# EAGLE design fl3xwatch (EAGLE 9.6.2)
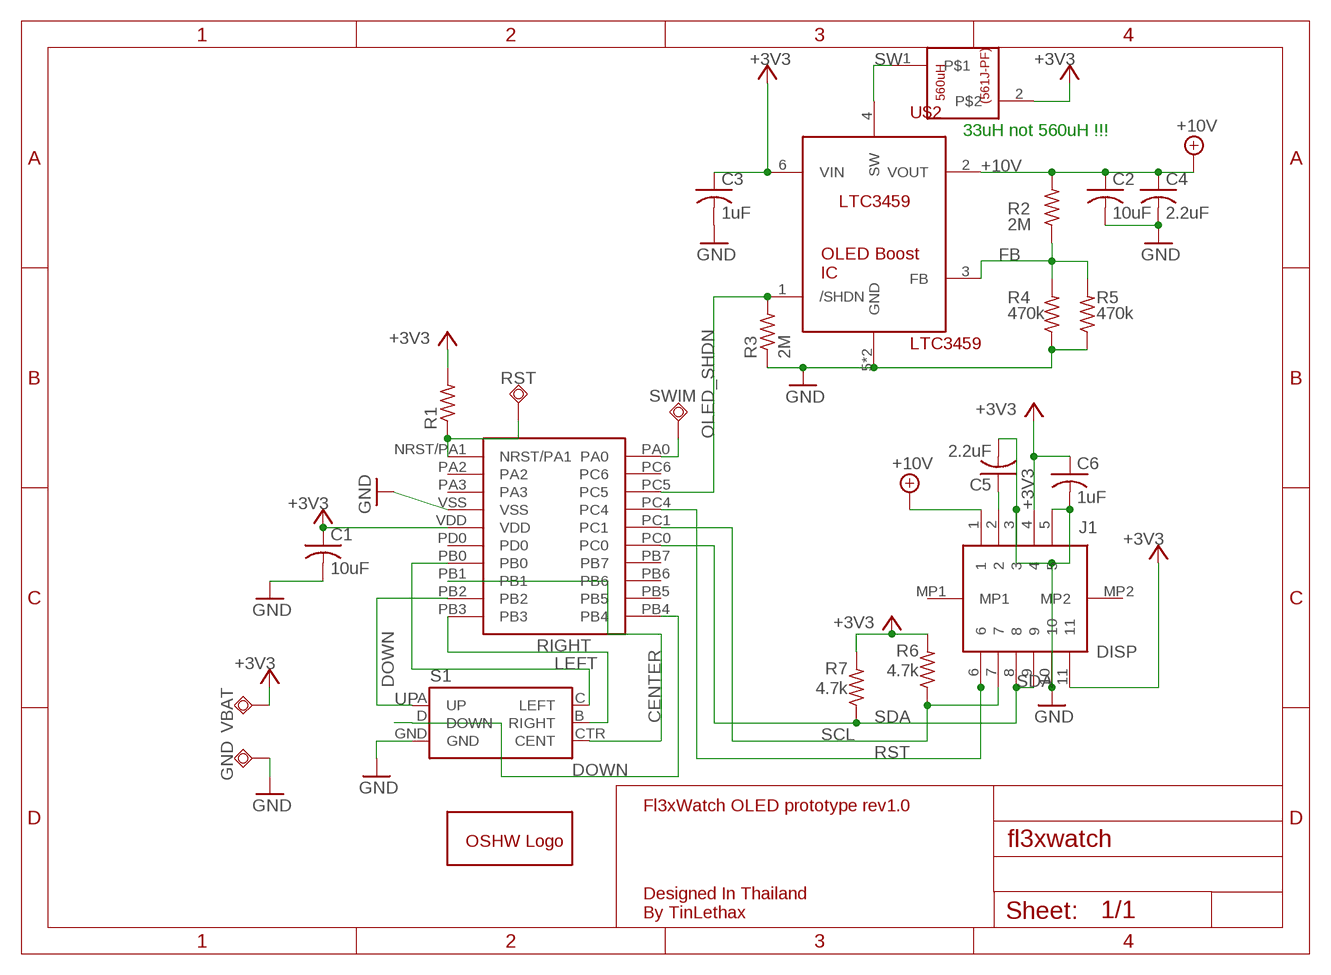
[diagram p0: schematic, sheet 1]

## Parts
C1  10uF  C-USC0805  [C0805]
C2  10uF  C-USC0805  [C0805]
C3  1uF  C-USC0603  [C0603]
C4  2.2uF  C-USC0603  [C0603]
C5  2.2uF  C-USC0603  [C0603]
C6  1uF  C-USC0603  [C0603]
GND  TPSQTP20SQ  [TP20SQ]
GOLD_ORB_SM1  OSHWLOGOLOGO5MM  [OSHW_5MM]
J1  DISP  FH35C-11S-0.3SHW_50_  [FH35C11S03SHW50]
L1  33uH  NL453232T-561J-PF  [INDC4526X50N]
R1  R-US_R0603  [R0603]
R2  2M  R-US_R0603  [R0603]
R3  2M  R-US_R0603  [R0603]
R4  470k  R-US_R0805  [R0805]
R5  470k  R-US_R0805  [R0805]
R6  4.7k  R-US_R0603  [R0603]
R7  4.7k  R-US_R0603  [R0603]
RST  TPSQTP15R  [TP15R]
S1  SPARKFUN-ELECTROMECHANICAL_JOYSTICK_MINI  [SPARKFUN-ELECTROMECHANICAL_JOYSTICK_MINI]
SWIM  TPSQTP15R  [TP15R]
U$1  STM8L151F3  [UFQFPN-20]
U$2  LTC3459  [SON50P300X200X75-7T165X135N]
VBAT  TPSQTP20SQ  [TP20SQ]

## Nets
+3V3: C1.1 C3.1 C6.1 J1.4 J1.11 L1.2 R1.2 R6.2 R7.2 U$1.VDD U$2.6(VIN) VBAT.TP
+10V: C2.1 C4.1 J1.1 R2.2 U$2.2(VOUT)
CENTER: S1.CTR(CENT) U$1.PB1
DOWN: S1.D(DOWN) U$1.PB4
FB: R2.1 R4.2 R5.2 U$2.3(FB)
GND: C1.2 C2.2 C3.2 C4.2 C5.2 C6.2 GND.TP J1.3 J1.5 J1.10 R3.1 R4.1 R5.1 S1.GND U$1.VSS U$2.5(GND) U$2.7(GND)
LEFT: S1.C(LEFT) U$1.PB0
N$1: R1.1 RST.TP U$1.NRST/PA1
N$2: C5.1 J1.2
N$7: SWIM.TP U$1.PA0
OLED_SHDN: R3.2 U$1.PC5 U$2.1(/SHDN)
RIGHT: S1.B(RIGHT) U$1.PB3
RST: J1.6 U$1.PC4
SCL: J1.7 R6.1 U$1.PC1
SDA: J1.8 J1.9 R7.1 U$1.PC0
SW: L1.1 U$2.4(SW)
UP: S1.A(UP) U$1.PB2
Unconnected: J1.MP1 J1.MP2 U$1.PA2 U$1.PA3 U$1.PB5 U$1.PB6 U$1.PB7 U$1.PC6 U$1.PD0

## Notes on the sheet
- 33uH not 560uH !!!
- Fl3xWatch OLED prototype rev1.0
- Designed In Thailand
  By TinLethax

## Library data of the parts
C1-C6 = adafruit:C-US: CAPACITOR, American symbol
GND RST SWIM VBAT = testpad:TPSQ: Test pad
GOLD_ORB_SM1 = oshw:OSHWLOGO: The OSHW logo for PCB layout
J1 = FH35C-11S-0.3SHW_50_:FH35C-11S-0.3SHW_50_: FFC & FPC Connectors 11P BCKFLP DUAL-SIDE FPC 0.3mm P 0.9mm H Source: Datasheet <http://www.mouser.com/datasheet/2/185/FH35C_catalog-939278.pdf>; DESCRIPTION: FFC & FPC Connectors 11P BCKFLP DUAL-SIDE FPC 0.3mm P 0.9mm H; HEIGHT: 1.8mm; MANUFACTURER_NAME: Hirose; MANUFACTURER_PART_NUMBER: FH35C-11S-0.3SHW(50); MOUSER_PART_NUMBER: 798-FH35C11S03SHW50; MOUSER_PRICE-STOCK: https://www.mouser.com/Search/Refine.aspx?Keyword=798-FH35C11S03SHW50
L1 = 561J-PF:NL453232T-561J-PF
R1-R7 = adafruit:R-US_: RESISTOR, American symbol
S1 = SparkFun_5-Way_Tactile_Switch_Breakout:SPARKFUN-ELECTROMECHANICAL_JOYSTICK_MINI: Small 5-way tactile joystick, COM-10063 4UCON SF303GJ26
U$1 = STM8L151F3:STM8L151F3: STM8L151F3 8bit mcuwith the 3x3 mm size !
U$2 = ltc3459:LTC3459: The LTC®3459 is a low current, high effi ciency synchronous boost converter intended for low power, size constrained portable applications. The LTC3459 can be powered from a single lithium ion battery, a 2- to 3-cell stack of alkaline or nickel batteries, or any low impedance voltage source between 1.5V and 5.5V. The output is programmable via an external divider between 2.5V and 10V. Although the part is primarily intended for boost applications, VOUT will maintain regulation below VIN (at reduced effi ciency). The LTC3459 offers Burst Mode operation with a fi xed peak current, providing high conversion effi ciency over a wide range of load currents. During start-up, inductor current is controlled preventing the inrush surge current found in many boost converters. In shutdown the output is disconnected from the input and quiescent current is reduced to <1μA.

## Board
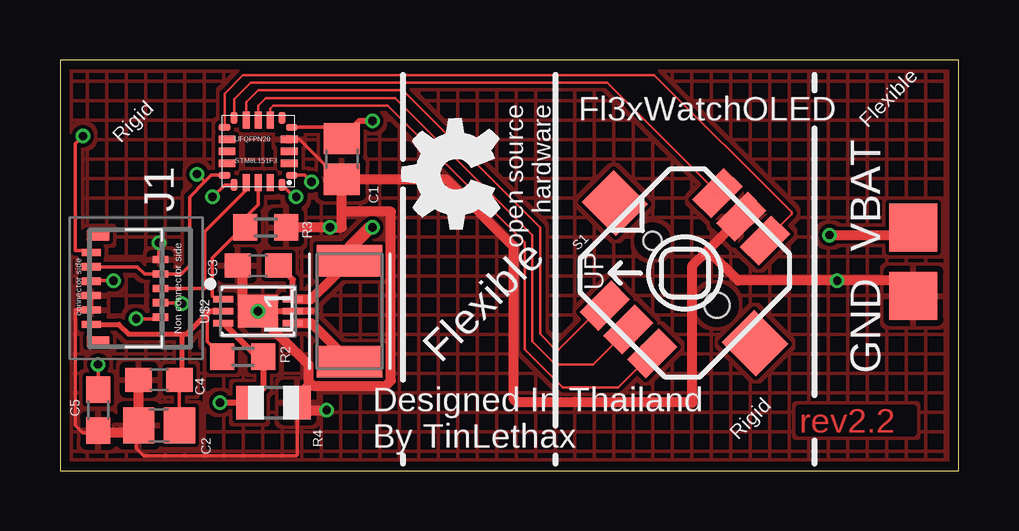
[diagram p1: board, top side]
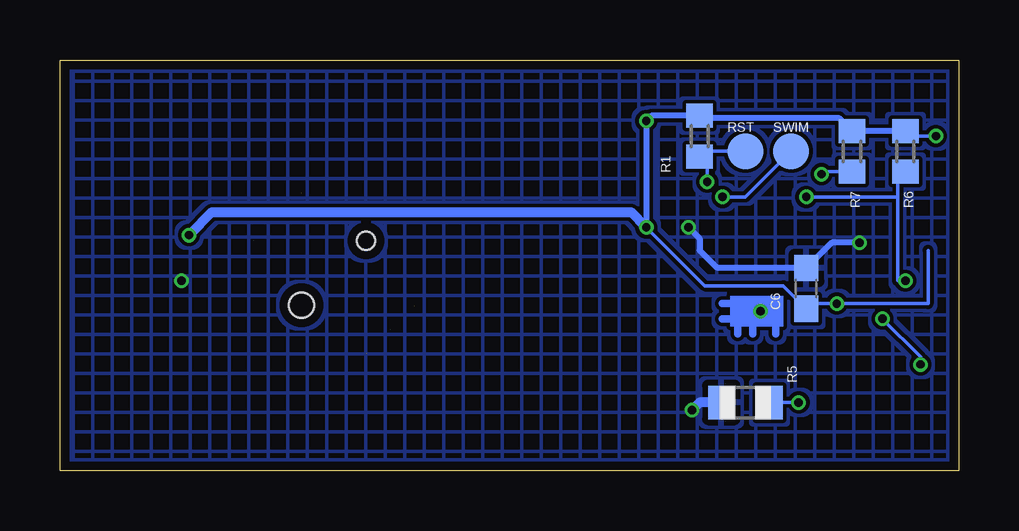
[diagram p2: board, bottom side, seen from below]

Size 37.45 x 17.14 mm. Coordinates in mm from the lower left corner, seen from the top.
Outline: 0,0 37.44,0 37.44,17.14 0,17.14 0,0
Copper layers (1*16): Top 0.035559375mm / dielectric 1.6mm / Bottom 0.035559375mm
Design rules "oshpark-2layer": minimum track width 6mil, minimum drill 10mil, track to track 6mil, track to pad 6mil, pad to pad 6mil, via to via 6mil, smd to smd 6mil, copper to edge 15mil, drill to drill 6mil, minimum pad ring 5mil, minimum via ring 5mil, stop-mask expansion 2.5mil, vias tented up to drill 0mil, thermal gap 10mil

### Footprints (pad centres in the part's own frame; a part is rotated, then mirrored left to right if it is on the bottom)
C0805 = smd 1.3 x 1.5: 1 -0.85,0; 2 0.85,0
C0603 = smd 1.1 x 1: 1 -0.85,0; 2 0.85,0
TP20SQ = smd 2 x 2: TP 0,0
FH35C11S03SHW50 = smd 0.3 x 0.8: 1 1.5,-1.869; 3 0.9,-1.869; 5 0.3,-1.869; 7 -0.3,-1.869; 9 -0.9,-1.869; 11 -1.5,-1.869 | smd 0.3 x 0.65: 2 1.2,1.006; 4 0.6,1.006; 6 0,1.006; 8 -0.6,1.006; 10 -1.2,1.006 | smd 0.4 x 0.95: MP1 -2.2,-1.594; MP2 2.2,-1.594
INDC4526X50N = smd 1.314 x 2.729: 1 -2.098,0; 2 2.098,0
R0603 = smd 1 x 1.1: 1 -0.85,0; 2 0.85,0
R0805 = smd 1.1 x 1.4: 1 -1,0; 2 1,0
TP15R = smd 1.5 x 1.5: TP 0,0
SPARKFUN-ELECTROMECHANICAL_JOYSTICK_MINI = smd 1.85 x 1.1: A -3.325,1.4; B 3.325,1.4; C -3.325,-1.4; CTR -3.325,0; D 3.325,-1.4; GND 3.325,0 | smd 1.9 x 2: NC 0,4.13; NC@0 0,-4.13 | hole 0.75: 0,1.9 | hole 1.05: 0,-1.9
UFQFPN-20 = smd 0.5 x 0.3: NRST/PA1 -1.4,1; PB4 1.4,-1; PC0 1.4,1; VDD -1.4,-1 | smd 0.3 x 0.5: PA0 -1,1.4; PB3 1,-1.4; PC1 1,1.4; PD0 -1,-1.4 | smd 0.7 x 0.3: PA2 -1.3,0.5; PA3 -1.3,0; PB5 1.3,-0.5; PB6 1.3,0; PB7 1.3,0.5; VSS -1.3,-0.5 | smd 0.3 x 0.7: PB0 -0.5,-1.3; PB1 0,-1.3; PB2 0.5,-1.3; PC4 0.5,1.3; PC5 0,1.3; PC6 -0.5,1.3
SON50P300X200X75-7T165X135N = smd 0.829 x 0.27: 1 -1.45,0.5; 2 -1.45,0; 3 -1.45,-0.5; 4 1.45,-0.5; 5 1.45,0; 6 1.45,0.5 | smd 1.65 x 1.35: 7 0,0

### Placement (x,y rotation side)
C1  11.75,13.02 270 top
C2  4.13,1.91 180 top
C3  8.26,8.57 180 top
C4  4.13,3.81 180 top
C5  1.59,2.54 270 top
C6  6.35,7.62 90 bottom
GND  35.56,7.3 90 top
GOLD_ORB_SM1  16.51,12.38 90 top
J1  3.17,7.62 270 top
L1  12.07,6.67 90 top
R1  10.79,13.97 90 bottom
R2  7.62,4.76 180 top
R3  8.57,10.16 180 top
R4  8.89,2.86 180 top
R5  8.89,2.86 0 bottom
R6  2.22,13.34 90 bottom
R7  4.45,13.34 90 bottom
RST  8.89,13.34 0 bottom
S1  26.04,8.26 45 top
SWIM  6.99,13.34 0 bottom
U$1  8.26,13.34 180 top
U$2  8.26,6.67 0 top
VBAT  35.56,10.16 90 top

### Tracks (layer width: path | path; a pad name or v marks a point on that pad's centre or on a via)
+3V3  (via drill 0.35)
  Top 0.152: U$1.VDD 11.28,14.34 C1.1 | J1.4 5.05,7.02 v5.08,6.99 | 1.39,9.21 J1.11 1.22,9.21 0.64,9.21 0.64,13.65 v0.95,13.97
  Top 0.254: U$2.6 9.7,7.97 C3.1 | C1.1 12.49,14.61 v13.02,14.61
  Top 0.406: U$2.6 10.47,7.17 11.33,8.03 | 11.33,8.03 L1.2 12.07,9.4 12.82,10.16 v13.02,10.16 11.33,8.48 11.33,8.03 | v32.07,9.84 35.24,9.84 VBAT.TP
  Bottom 0.152: R1.2 10.9,14.71 | 1.8,14.19 R6.2 | 1.27,9.21 1.27,6.99 v5.08,6.99 6.13,6.99 C6.1 7.3,7.72 10.58,7.72 v13.02,10.16 | v0.95,13.97 2.32,13.97 2.54,14.19
  Bottom 0.254: R6.2 2.54,14.19 R7.2 4.97,14.71 10.9,14.71 | R1.2 12.8,14.82 v13.02,14.61 v13.02,10.16
  Bottom 0.406: v32.07,9.84 31.11,10.79 13.65,10.79 v13.02,10.16
+10V
  Top 0.152: 6.13,6.57 6.13,5.4 R2.2 | C4.1 C2.1 | 6.24,6.67 6.35,6.67
  Top 0.203: J1.1 2.45,6.12 2.86,5.71 5.08,5.71 | 6.13,6.57 5.29,5.71 5.08,5.71 | 5.08,5.71 5.08,3.91 C4.1
  Top 0.254: 6.35,6.67 U$2.2 | 6.13,6.57 6.24,6.67
CENTER  (1 unrouted)
  Top 0.102: U$1.PB1 8.26,15.24 8.57,15.56 13.97,15.56 19.68,9.84 19.68,5.4 20.64,4.45 22.22,4.45 S1.CTR
DOWN  (1 unrouted)
  Top 0.102: U$1.PB4 6.85,15.74 7.62,16.51 24.77,16.51 30.48,10.79 30.48,10.72 S1.D
FB  (via drill 0.35)
  Top 0.254: v6.67,2.86 R5.2 8.47,3.44 R2.1 8.21,4.76 U$2.3
  Bottom 0.152: v6.67,2.86 R5.2
GND  (via drill 0.35)
  Top 0.102: 11.75,12.06 11.7,12.12
  Top 0.152: 9.52,5.4 U$2.7 7.72,7.2 7.72,8.57 C3.2 | 10.52,3.76 10.52,3.49 R5.1 | 3.28,3.49 C4.2 3.59,4.13 | U$1.VSS 9.98,13.84 11.7,12.12 C1.2 | 9.31,10.16 R3.1 | R5.1 9.89,0.68 9.84,0.64 3.49,0.64 3.17,0.95 3.17,1.8 C2.2 | J1.5 J1.3 0.64,6.72 0.64,1.91 0.95,1.59 1.48,1.59 C5.2 | R5.1 9.89,3.31 10.34,3.77
  Top 0.254: U$2.7 9.21,6.67 U$2.5 | J1.10 4.18,9.47 v4.13,9.53
  Top 0.305: U$2.5 10.48,6.67
  Top 0.406: C5.2 1.69,1.59 2.96,1.59 C2.2 3.28,3.49 | 11.75,10.79 11.75,10.16 v11.25,10.16 R3.1 | 11.75,10.79 11.75,12.06 | S1.GND 26.99,9.21 | C1.2 16.09,12.17 18.89,9.37 18.89,3.02 19.05,2.86 26.35,2.86 26.35,8.57 26.99,9.21 | GND.TP 34.93,7.94 v32.39,7.94 28.26,7.94 26.99,9.21 | R5.1 10.21,2.54 v11.11,2.54 | C3.2 7.6,8.57 7.6,7.03 7.98,6.64 8.14,6.64 10.34,4.44 10.34,3.77 10.55,3.56 13.58,3.56 13.79,3.77 13.79,10.82 11.77,10.82 11.75,10.79
  Bottom 0.254: v4.13,9.53 5.3,9.53 C6.2 10.06,8.47 10.79,9.21 10.79,9.7 v11.25,10.16
  Bottom 0.406: R5.1 10.79,2.86 v11.11,2.54
  other vias: 8.26,6.67
  pour Top (hatched): 0,17.14 37.47,17.14 37.47,0 0,0
  pour Bottom (hatched): 0,17.14 37.47,17.14 37.47,0 0,0
LEFT  (1 unrouted)
  Top 0.102: U$1.PB0 8.76,15.11 8.89,15.24 13.65,15.24 19.37,9.53 19.37,5.08 20.95,3.49 23.25,3.49 S1.C
N$1  (via drill 0.35)
  Top 0.152: v10.48,12.06 10.21,12.34 U$1.NRST/PA1
  Bottom 0.152: RST.TP 10.48,13.34 v10.48,12.06 10.48,12.8 R1.1
N$2  (via drill 0.35)
  Top 0.152: J1.2 4.18,6.35 v3.17,6.35 | v1.59,4.45 C5.1
  Bottom 0.152: v3.17,6.35 1.59,4.76 v1.59,4.45
N$3
  Bottom 0.305: 9.21,6.99 9.84,6.99
N$4
  Bottom 0.305: 9.21,6.35 9.84,6.35
N$5
  Bottom 0.305: 7.62,6.35 7.62,5.71
N$6
  Bottom 0.305: 8.57,6.03 8.57,5.71
N$7  (via drill 0.35)
  Top 0.152: U$1.PA0 9.76,11.43 v9.84,11.43
  Bottom 0.152: v9.84,11.43 8.89,11.43 SWIM.TP
N$8
  Bottom 0.305: 9.21,6.03 9.21,5.71
OLED_SHDN
  Top 0.152: U$2.1 6.49,7.17 6.35,7.3 6.35,8.89 7.41,9.95 7.51,9.95 R3.2 7.72,10.58 8.26,11.11 U$1.PC5
RIGHT  (1 unrouted)
  Top 0.102: U$1.PB3 7.26,15.51 7.94,16.19 22.8,16.19 S1.B
RST
  Top 0.152: U$1.PC4 7.76,11.72 6.03,9.99 6.03,7.62 J1.6
SCL  (via drill 0.35)
  Top 0.152: U$1.PC1 6.85,11.94 v6.35,11.43 | J1.7 1.32,7.94 v2.22,7.94
  Bottom 0.152: 2.54,11.43 v6.35,11.43 | v2.22,7.94 2.54,7.94 2.54,11.43 | R6.1 2.54,12.17 2.54,11.43
SDA  (via drill 0.35)
  Top 0.152: 6.03,12.06 6.3,12.34 U$1.PC0 | 6.03,12.06 5.4,11.43 5.4,8.57 5.05,8.22 J1.8 3.53,8.22 3.23,8.52 J1.9 | v5.71,12.38 6.03,12.06
  Bottom 0.152: R7.1 5.61,12.48 v5.71,12.38
SW
  Top 0.406: U$2.4 10.47,6.17 L1.1
UP  (1 unrouted)
  Top 0.102: S1.A 22.69,6.99 20.79,5.08 20.64,5.08 20,5.71 20,10.16 14.29,15.88 8.26,15.88 7.76,15.38 U$1.PB2
(copper drawn outside any net)
  shapes: Bottom area x1

### Text on the board
Top: rev2.2
tNames: Fl3xWatchOLED | Rigid | Flexible | Flexible | Designed In Thailand / By TinLethax | Rigid